# Altium schematic sheet encoder.SchDoc
size A3
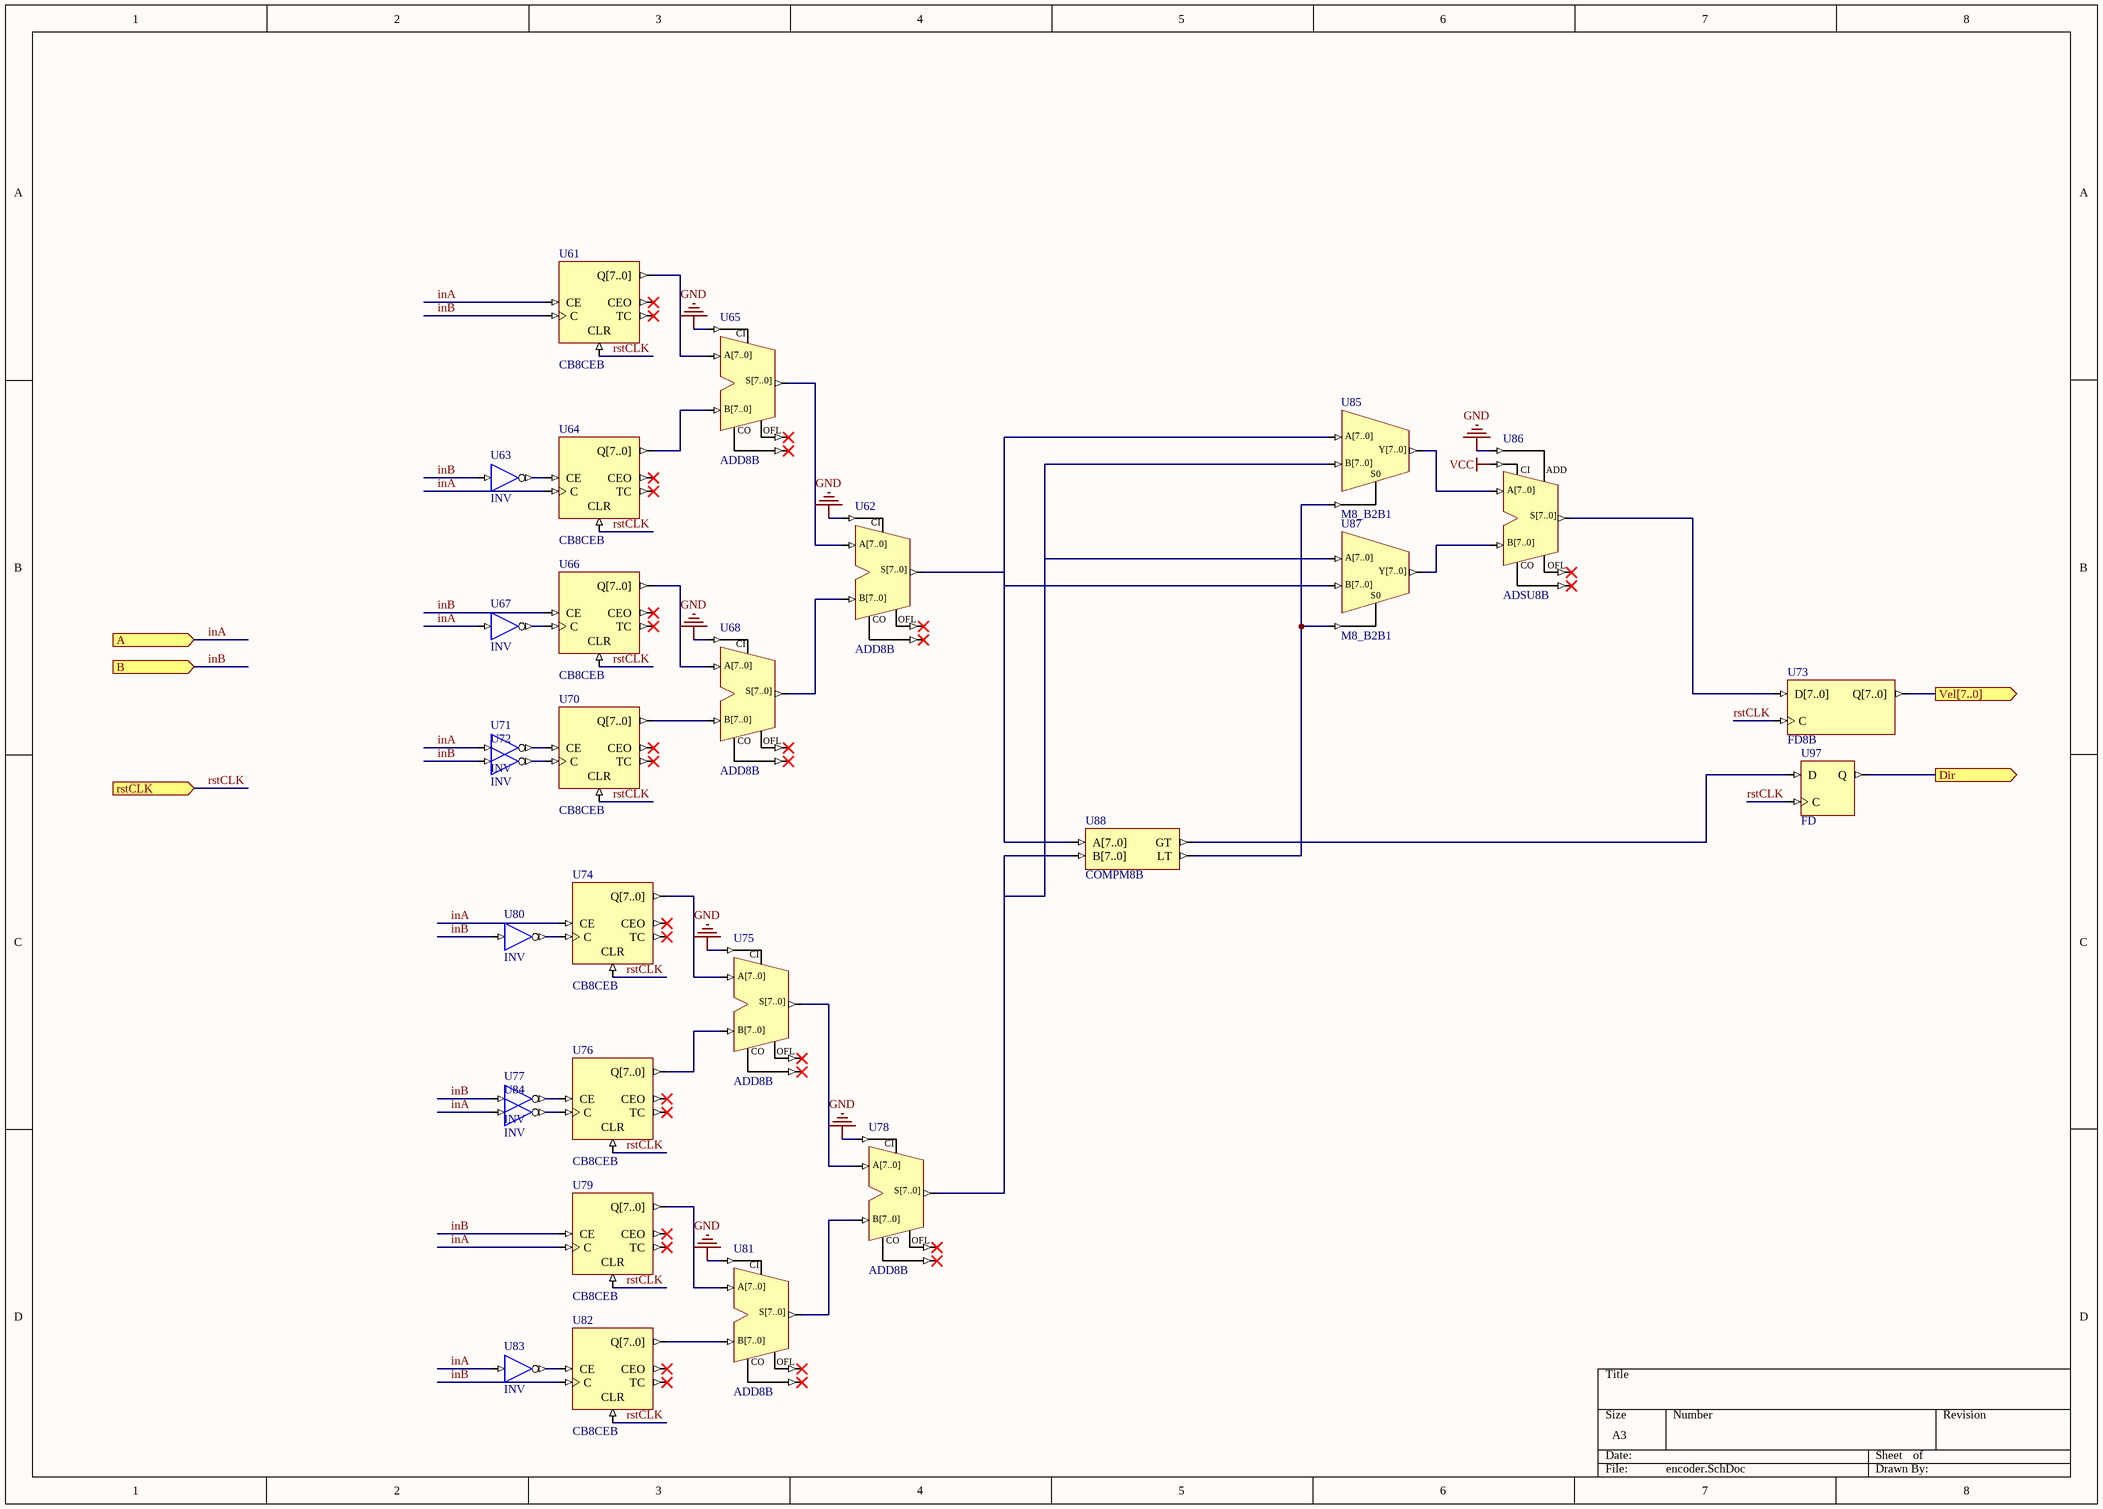
[diagram p0: encoder.SchDoc]

## Parts
U61  CB8CEB
U62  ADD8B
U63  INV
U64  CB8CEB
U65  ADD8B
U66  CB8CEB
U67  INV
U68  ADD8B
U70  CB8CEB
U71  INV
U72  INV
U73  FD8B
U74  CB8CEB
U75  ADD8B
U76  CB8CEB
U77  INV
U78  ADD8B
U79  CB8CEB
U80  INV
U81  ADD8B
U82  CB8CEB
U83  INV
U84  INV
U85  M8_B2B1
U86  ADSU8B
U87  M8_B2B1
U88  COMPM8B
U97  FD

## Ports
A (in), B (in), Dir (out), rstCLK (in), Vel[7..0] (out)

## Nets
GND: U62.CI U65.CI U68.CI U75.CI U78.CI U81.CI U86.ADD
VCC: U86.CI
Dir: U97.Q ; port Dir
inA: U61.CE U64.C U67.I U71.I U74.CE U79.C U83.I U84.I ; port A
inB: U61.C U63.I U66.CE U72.I U77.I U79.CE U80.I U82.C ; port B
rstCLK: U61.CLR U64.CLR U66.CLR U70.CLR U73.C U74.CLR U76.CLR U79.CLR U82.CLR U97.C ; port rstCLK
Vel[7..0]: U73.Q[7..0] ; port Vel[7..0]
NetU61_Q[7..0]: U61.Q[7..0] U65.A[7..0]
NetU62_A[7..0]: U62.A[7..0] U65.S[7..0]
NetU62_B[7..0]: U62.B[7..0] U68.S[7..0]
NetU62_S[7..0]: U62.S[7..0] U85.A[7..0] U87.B[7..0] U88.A[7..0]
NetU63_O: U63.O U64.CE
NetU64_Q[7..0]: U64.Q[7..0] U65.B[7..0]
NetU66_C: U66.C U67.O
NetU66_Q[7..0]: U66.Q[7..0] U68.A[7..0]
NetU68_B[7..0]: U68.B[7..0] U70.Q[7..0]
NetU70_C: U70.C U72.O
NetU70_CE: U70.CE U71.O
NetU73_D[7..0]: U73.D[7..0] U86.S[7..0]
NetU74_C: U74.C U80.O
NetU74_Q[7..0]: U74.Q[7..0] U75.A[7..0]
NetU75_B[7..0]: U75.B[7..0] U76.Q[7..0]
NetU75_S[7..0]: U75.S[7..0] U78.A[7..0]
NetU76_C: U76.C U84.O
NetU76_CE: U76.CE U77.O
NetU78_B[7..0]: U78.B[7..0] U81.S[7..0]
NetU78_S[7..0]: U78.S[7..0] U85.B[7..0] U87.A[7..0] U88.B[7..0]
NetU79_Q[7..0]: U79.Q[7..0] U81.A[7..0]
NetU81_B[7..0]: U81.B[7..0] U82.Q[7..0]
NetU82_CE: U82.CE U83.O
NetU85_S0: U85.S0 U87.S0 U88.LT
NetU85_Y[7..0]: U85.Y[7..0] U86.A[7..0]
NetU86_B[7..0]: U86.B[7..0] U87.Y[7..0]
NetU88_GT: U88.GT U97.D

Not connected (* = marked no-connect by the designer): U61 CEO* TC*; U62 CO* OFL*; U64 CEO* TC*; U65 CO* OFL*; U66 CEO* TC*; U68 CO* OFL*; U70 CEO* TC*; U74 CEO* TC*; U75 CO* OFL*; U76 CEO* TC*; U78 CO* OFL*; U79 CEO* TC*; U81 CO* OFL*; U82 CEO* TC*; U86 CO* OFL*

## Library data of the parts
U61 U64 U66 U70 U74 U76 U79 U82 = CB8CEB: 8-Bit Cascadable Binary Counters with Clock Enable and Asynchronous Clear, Bus Version; XilinxEquivalent: CB8CE; ClockTrigger: Rising; Enable: High; PortSize: 8; ArchiveName: GENERIC; VHDLIB_SIM: GENERIC_LIB; Published: 29-Jan-2004; Publisher: Altium Limited; LastRevisionNo: 1.00.00; HelpURL: CR0118 FPGA Generic Library Guide.pdf#page=128; ComponentLink1URL: CR0130 FPGA Counter Resource Usage.pdf#page=23; ComponentLink1Description: Core &Resource Usage; FunctionalClass: Counter; SubClass: Binary; Reset: Asynchronous; PortType: Bus Version
U62 U65 U68 U75 U78 U81 = ADD8B: 8-Bit Cascadable Full Adder with Signed and Unsigned Operations, Bus Version; XilinxEquivalent: ADD8; FunctionalClass: Arithmetic Function; SubClass: ADD; PortSize: 8; ArchiveName: GENERIC; VHDLIB_SIM: GENERIC_LIB; Published: 29-Jan-2004; Publisher: Altium Limited; LastRevisionNo: 1.00.00; HelpURL: CR0118 FPGA Generic Library Guide.pdf#page=98; ComponentLink1URL: CR0124 FPGA Arithmetic Function Resource Usage.pdf#page=16; ComponentLink1Description: Core &Resource Usage; PortStyle: Bus Version
U63 U67 U71 U72 U77 U80 U83 U84 = INV: Inverter; FunctionalClass: Logic Primitive; ArchiveName: GENERIC; VHDLIB_SIM: GENERIC_LIB; Published: 29-Jan-2004; Publisher: Altium Limited; XilinxEquivalent: INV; LastRevisionNo: 1.00.00; HelpURL: CR0118 FPGA Generic Library Guide.pdf#page=291; ComponentLink1URL: CR0136 FPGA Logic Primitive Resource Usage.pdf#page=61; ComponentLink1Description: Core &Resource Usage; SubClass: INV
U73 = FD8B: 8-Bit D-Type Flip-Flop, Bus Version; XilinxEquivalent: FD8; SubClass: FD; ClockTrigger: Rising; PortSize: 8; ArchiveName: GENERIC; VHDLIB_SIM: GENERIC_LIB; Published: 29-Jan-2004; Publisher: Altium Limited; LastRevisionNo: 1.00.00; HelpURL: CR0118 FPGA Generic Library Guide.pdf#page=170; ComponentLink1URL: CR0133 FPGA Flip Flop Resource Usage.pdf#page=69; ComponentLink1Description: Core &Resource Usage; FunctionalClass: Flip-Flop; PortStyle: Bus Version
U85 U87 = M8_B2B1: 2x8-Bit Bus to 1x8-Bit Bus Multiplexer; SubClass: BnB1; PortSize: 8; PortStyle: Bus Version; ArchiveName: GENERIC; VHDLIB_SIM: GENERIC_LIB; Published: 29-Jan-2004; Publisher: Altium Limited; LastRevisionNo: 1.00.00; HelpURL: CR0118 FPGA Generic Library Guide.pdf#page=364; ComponentLink1URL: CR0137 FPGA Multiplexer Resource Usage.pdf#page=302; ComponentLink1Description: Core &Resource Usage; FunctionalClass: Multiplexer
U86 = ADSU8B: 8-Bit Cascadable Full Adder/Subtracter with Signed and Unsigned Operations, Bus Version; XilinxEquivalent: ADSU8; FunctionalClass: Arithmetic Function; SubClass: ADSU; PortSize: 8; ArchiveName: GENERIC; VHDLIB_SIM: GENERIC_LIB; Published: 29-Jan-2004; Publisher: Altium Limited; LastRevisionNo: 1.00.00; HelpURL: CR0118 FPGA Generic Library Guide.pdf#page=107; ComponentLink1URL: CR0124 FPGA Arithmetic Function Resource Usage.pdf#page=46; ComponentLink1Description: Core &Resource Usage; PortStyle: Bus Version
U88 = COMPM8B: 8-Bit Magnitude Comparator, Bus Version; XilinxEquivalent: COMPM8; SubClass: COMPM; PortSize: 8; ArchiveName: GENERIC; VHDLIB_SIM: GENERIC_LIB; Published: 29-Jan-2004; Publisher: Altium Limited; LastRevisionNo: 1.00.00; HelpURL: CR0118 FPGA Generic Library Guide.pdf#page=153; ComponentLink1URL: CR0129 FPGA Comparator Resource Usage.pdf#page=37; ComponentLink1Description: Core &Resource Usage; FunctionalClass: Comparator; PortStyle: Bus Version
U97 = FD: D-Type Flip-Flop; ClockTrigger: Rising; ArchiveName: GENERIC; VHDLIB_SIM: GENERIC_LIB; Published: 29-Jan-2004; Publisher: Altium Limited; XilinxEquivalent: FD; LastRevisionNo: 1.00.00; HelpURL: CR0118 FPGA Generic Library Guide.pdf#page=170; ComponentLink1URL: CR0133 FPGA Flip Flop Resource Usage.pdf#page=4; ComponentLink1Description: Core &Resource Usage; FunctionalClass: Flip-Flop; SubClass: FD